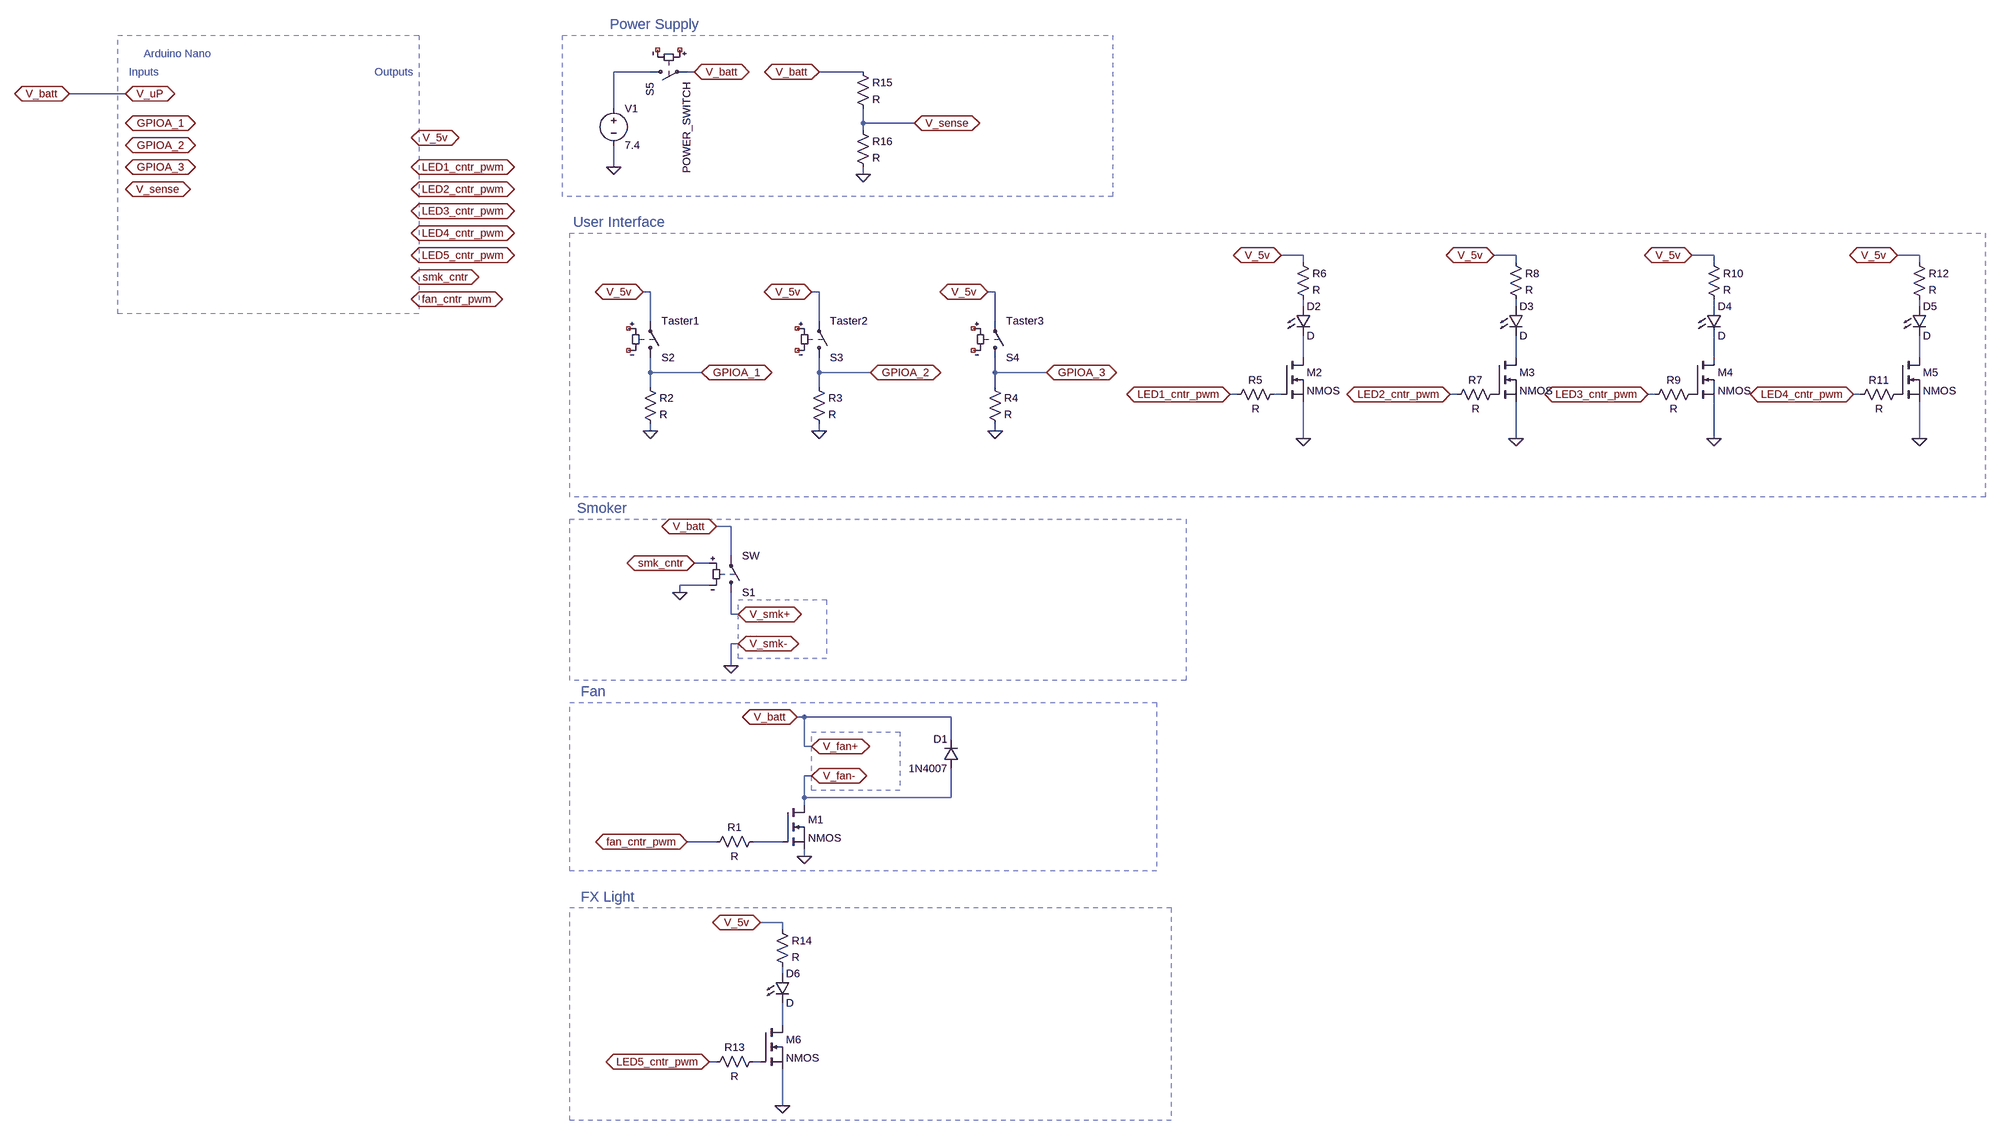
[diagram p0: schematic 210100_GeneralCircuit.asc]
210100_GeneralCircuit.asc, the LTspice schematic file:
Version 4
SHEET 1 5860 1092
WIRE 2800 -1200 2720 -1200
WIRE 2896 -1200 2880 -1200
WIRE 3264 -1200 3168 -1200
WIRE 1648 -1152 1504 -1152
WIRE 2720 -1120 2720 -1200
WIRE 3264 -1088 3264 -1120
WIRE 3376 -1088 3264 -1088
WIRE 3264 -1072 3264 -1088
WIRE 2720 -992 2720 -1040
WIRE 3264 -976 3264 -992
WIRE 4224 -800 4176 -800
WIRE 4688 -800 4640 -800
WIRE 5120 -800 5072 -800
WIRE 5568 -800 5520 -800
WIRE 4224 -784 4224 -800
WIRE 4688 -784 4688 -800
WIRE 5120 -784 5120 -800
WIRE 5568 -784 5568 -800
WIRE 2800 -720 2784 -720
WIRE 3168 -720 3152 -720
WIRE 3552 -720 3536 -720
WIRE 4224 -688 4224 -704
WIRE 4688 -688 4688 -704
WIRE 5120 -688 5120 -704
WIRE 5568 -688 5568 -704
WIRE 2800 -656 2800 -720
WIRE 3168 -656 3168 -720
WIRE 3552 -656 3552 -720
WIRE 4224 -576 4224 -624
WIRE 4688 -576 4688 -624
WIRE 5120 -576 5120 -624
WIRE 5568 -576 5568 -624
WIRE 2800 -544 2800 -576
WIRE 2912 -544 2800 -544
WIRE 3168 -544 3168 -576
WIRE 3280 -544 3168 -544
WIRE 3552 -544 3552 -576
WIRE 3664 -544 3552 -544
WIRE 2800 -512 2800 -544
WIRE 3168 -512 3168 -544
WIRE 3552 -512 3552 -544
WIRE 4080 -496 4064 -496
WIRE 4176 -496 4160 -496
WIRE 4560 -496 4544 -496
WIRE 4992 -496 4976 -496
WIRE 5440 -496 5424 -496
WIRE 2800 -416 2800 -432
WIRE 3168 -416 3168 -432
WIRE 3552 -416 3552 -432
WIRE 4224 -400 4224 -480
WIRE 4688 -400 4688 -480
WIRE 5120 -400 5120 -480
WIRE 5568 -400 5568 -480
WIRE 2976 -208 2944 -208
WIRE 2976 -144 2976 -208
WIRE 2928 -128 2896 -128
WIRE 2928 -80 2864 -80
WIRE 2864 -64 2864 -80
WIRE 2976 -16 2976 -64
WIRE 2992 -16 2976 -16
WIRE 2992 48 2976 48
WIRE 2976 96 2976 48
WIRE 3136 208 3120 208
WIRE 3456 208 3136 208
WIRE 3456 256 3456 208
WIRE 3136 272 3136 208
WIRE 3152 272 3136 272
WIRE 3152 336 3136 336
WIRE 3136 384 3136 336
WIRE 3456 384 3456 320
WIRE 3456 384 3136 384
WIRE 3136 400 3136 384
WIRE 2944 480 2880 480
WIRE 3088 480 3024 480
WIRE 3136 512 3136 496
WIRE 3088 656 3040 656
WIRE 3088 672 3088 656
WIRE 3088 768 3088 752
WIRE 3088 880 3088 832
WIRE 2944 960 2928 960
WIRE 3040 960 3024 960
WIRE 3088 1056 3088 976
FLAG 2720 -992 0
FLAG 2896 -1200 V_batt
IOPIN 2896 -1200 BiDir
FLAG 2992 -16 V_smk+
IOPIN 2992 -16 BiDir
FLAG 1648 -1152 V_uP
IOPIN 1648 -1152 BiDir
FLAG 2896 -128 smk_cntr
IOPIN 2896 -128 BiDir
FLAG 1504 -1152 V_batt
IOPIN 1504 -1152 BiDir
FLAG 2272 -1056 V_5v
IOPIN 2272 -1056 BiDir
FLAG 2944 -208 V_batt
IOPIN 2944 -208 BiDir
FLAG 2992 48 V_smk-
IOPIN 2992 48 BiDir
FLAG 2864 -64 0
FLAG 2976 96 0
FLAG 3152 272 V_fan+
IOPIN 3152 272 BiDir
FLAG 3152 336 V_fan-
IOPIN 3152 336 BiDir
FLAG 3136 512 0
FLAG 2880 480 fan_cntr_pwm
IOPIN 2880 480 BiDir
FLAG 3120 208 V_batt
IOPIN 3120 208 BiDir
FLAG 2784 -720 V_5v
IOPIN 2784 -720 BiDir
FLAG 2800 -416 0
FLAG 2912 -544 GPIOA_1
IOPIN 2912 -544 BiDir
FLAG 3152 -720 V_5v
IOPIN 3152 -720 BiDir
FLAG 3168 -416 0
FLAG 3280 -544 GPIOA_2
IOPIN 3280 -544 BiDir
FLAG 3536 -720 V_5v
IOPIN 3536 -720 BiDir
FLAG 3552 -416 0
FLAG 3664 -544 GPIOA_3
IOPIN 3664 -544 BiDir
FLAG 4064 -496 LED1_cntr_pwm
IOPIN 4064 -496 BiDir
FLAG 4224 -400 0
FLAG 4176 -800 V_5v
IOPIN 4176 -800 BiDir
FLAG 4544 -496 LED2_cntr_pwm
IOPIN 4544 -496 BiDir
FLAG 4688 -400 0
FLAG 4640 -800 V_5v
IOPIN 4640 -800 BiDir
FLAG 4976 -496 LED3_cntr_pwm
IOPIN 4976 -496 BiDir
FLAG 5120 -400 0
FLAG 5072 -800 V_5v
IOPIN 5072 -800 BiDir
FLAG 5424 -496 LED4_cntr_pwm
IOPIN 5424 -496 BiDir
FLAG 5568 -400 0
FLAG 5520 -800 V_5v
IOPIN 5520 -800 BiDir
FLAG 2928 960 LED5_cntr_pwm
IOPIN 2928 960 BiDir
FLAG 3088 1056 0
FLAG 3040 656 V_5v
IOPIN 3040 656 BiDir
FLAG 1648 -1088 GPIOA_1
IOPIN 1648 -1088 BiDir
FLAG 1648 -1040 GPIOA_2
IOPIN 1648 -1040 BiDir
FLAG 1648 -992 GPIOA_3
IOPIN 1648 -992 BiDir
FLAG 2272 -992 LED1_cntr_pwm
IOPIN 2272 -992 BiDir
FLAG 2272 -944 LED2_cntr_pwm
IOPIN 2272 -944 BiDir
FLAG 2272 -896 LED3_cntr_pwm
IOPIN 2272 -896 BiDir
FLAG 2272 -848 LED4_cntr_pwm
IOPIN 2272 -848 BiDir
FLAG 2272 -800 LED5_cntr_pwm
IOPIN 2272 -800 BiDir
FLAG 2272 -752 smk_cntr
IOPIN 2272 -752 BiDir
FLAG 2272 -704 fan_cntr_pwm
IOPIN 2272 -704 BiDir
FLAG 3168 -1200 V_batt
IOPIN 3168 -1200 BiDir
FLAG 3264 -976 0
FLAG 3376 -1088 V_sense
IOPIN 3376 -1088 BiDir
FLAG 1648 -944 V_sense
IOPIN 1648 -944 BiDir
SYMBOL voltage 2720 -1136 R0
WINDOW 123 0 0 Left 0
WINDOW 39 0 0 Left 0
SYMATTR InstName V1
SYMATTR Value 7.4
SYMBOL sw 2976 -48 M180
SYMATTR InstName S1
SYMBOL diode 3472 320 R180
WINDOW 0 24 64 Left 2
WINDOW 3 24 0 Left 2
SYMATTR InstName D1
SYMATTR Value 1N4007
SYMBOL nmos 3088 400 R0
SYMATTR InstName M1
SYMBOL res 3040 464 R90
WINDOW 0 0 56 VBottom 2
WINDOW 3 32 56 VTop 2
SYMATTR InstName R1
SYMBOL sw 2800 -560 M180
SYMATTR InstName S2
SYMATTR Value Taster1
SYMBOL res 2784 -528 R0
SYMATTR InstName R2
SYMBOL sw 3168 -560 M180
SYMATTR InstName S3
SYMATTR Value Taster2
SYMBOL res 3152 -528 R0
SYMATTR InstName R3
SYMBOL sw 3552 -560 M180
SYMATTR InstName S4
SYMATTR Value Taster3
SYMBOL res 3536 -528 R0
SYMATTR InstName R4
SYMBOL sw 2784 -1200 M90
SYMATTR InstName S5
SYMATTR Value POWER_SWITCH
SYMBOL nmos 4176 -576 R0
SYMATTR InstName M2
SYMBOL res 4176 -512 R90
WINDOW 0 0 56 VBottom 2
WINDOW 3 32 56 VTop 2
SYMATTR InstName R5
SYMBOL res 4208 -800 R0
SYMATTR InstName R6
SYMBOL LED 4208 -688 R0
SYMATTR InstName D2
SYMBOL nmos 4640 -576 R0
SYMATTR InstName M3
SYMBOL res 4656 -512 R90
WINDOW 0 0 56 VBottom 2
WINDOW 3 32 56 VTop 2
SYMATTR InstName R7
SYMBOL res 4672 -800 R0
SYMATTR InstName R8
SYMBOL LED 4672 -688 R0
SYMATTR InstName D3
SYMBOL nmos 5072 -576 R0
SYMATTR InstName M4
SYMBOL res 5088 -512 R90
WINDOW 0 0 56 VBottom 2
WINDOW 3 32 56 VTop 2
SYMATTR InstName R9
SYMBOL res 5104 -800 R0
SYMATTR InstName R10
SYMBOL LED 5104 -688 R0
SYMATTR InstName D4
SYMBOL nmos 5520 -576 R0
SYMATTR InstName M5
SYMBOL res 5536 -512 R90
WINDOW 0 0 56 VBottom 2
WINDOW 3 32 56 VTop 2
SYMATTR InstName R11
SYMBOL res 5552 -800 R0
SYMATTR InstName R12
SYMBOL LED 5552 -688 R0
SYMATTR InstName D5
SYMBOL nmos 3040 880 R0
SYMATTR InstName M6
SYMBOL res 3040 944 R90
WINDOW 0 0 56 VBottom 2
WINDOW 3 32 56 VTop 2
SYMATTR InstName R13
SYMBOL res 3072 656 R0
SYMATTR InstName R14
SYMBOL LED 3072 768 R0
SYMATTR InstName D6
SYMBOL res 3248 -1216 R0
SYMATTR InstName R15
SYMBOL res 3248 -1088 R0
SYMATTR InstName R16
TEXT 1688 -1240 Left 2 ;Arduino Nano
TEXT 1656 -1200 Left 2 ;Inputs
TEXT 2192 -1200 Left 2 ;Outputs
TEXT 2640 -248 Left 3 ;Smoker
TEXT 2648 152 Left 3 ;Fan
TEXT 2632 -872 Left 3 ;User Interface
TEXT 2648 600 Left 3 ;FX Light
TEXT 2712 -1304 Left 3 ;Power Supply
RECTANGLE Normal 2288 -672 1632 -1280 2
RECTANGLE Normal 3184 80 2992 -48 2
RECTANGLE Normal 3344 368 3152 240 2
RECTANGLE Normal 3808 -928 2608 -1280 2
RECTANGLE Normal 5712 -272 2624 -848 2
RECTANGLE Normal 3968 128 2624 -224 2
RECTANGLE Normal 3904 544 2624 176 2
RECTANGLE Normal 3936 1088 2624 624 2

The netlist it stands for:
* 210100_GeneralCircuit.asc
V1 N001 0 7.4
S1 V_smk+ V_fan+ smk_cntr 0 SW
D1 V_fan- V_fan+ 1N4007
M1 V_fan- N011 0 0 NMOS
R1 N011 fan_cntr_pwm R
S2 GPIOA_1 V_5v NC_01 NC_02 Taster1
R2 GPIOA_1 0 R
S3 GPIOA_2 V_5v NC_03 NC_04 Taster2
R3 GPIOA_2 0 R
S4 GPIOA_3 V_5v NC_05 NC_06 Taster3
R4 GPIOA_3 0 R
S5 N001 V_fan+ NC_07 NC_08 POWER_SWITCH
M2 N006 N010 0 0 NMOS
R5 N010 LED1_cntr_pwm R
R6 V_5v N002 R
D2 N002 N006 D
M3 N007 P001 0 0 NMOS
R7 P001 LED2_cntr_pwm R
R8 V_5v N003 R
D3 N003 N007 D
M4 N008 P002 0 0 NMOS
R9 P002 LED3_cntr_pwm R
R10 V_5v N004 R
D4 N004 N008 D
M5 N009 P003 0 0 NMOS
R11 P003 LED4_cntr_pwm R
R12 V_5v N005 R
D5 N005 N009 D
M6 N013 N014 0 0 NMOS
R13 N014 LED5_cntr_pwm R
R14 V_5v N012 R
D6 N012 N013 D
R15 V_fan+ V_sense R
R16 V_sense 0 R
.model D D
.lib standard.dio
.model NMOS NMOS
.model PMOS PMOS
.lib standard.mos
* Arduino Nano
* Inputs
* Outputs
* Smoker
* Fan
* User Interface
* FX Light
* Power Supply
.backanno
.end